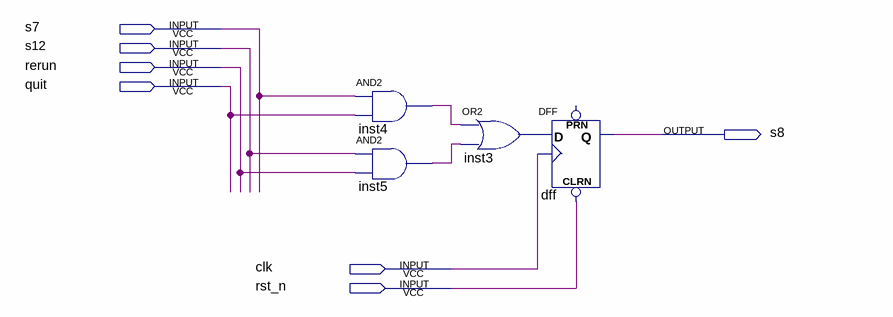
[diagram p0: schematic sheet]
// Quartus schematic s8.bdf as structural Verilog: 4 symbols, 7 pins
module s8 (
  input  s7,
  input  s12,
  input  rerun,
  input  quit,
  input  clk,
  input  rst_n,
  output s8
);

  wire inst3_out, inst4_out, inst5_out;

  and inst4 (inst4_out, s7, quit);
  and inst5 (inst5_out, s12, rerun);
  or inst3 (inst3_out, inst4_out, inst5_out);
  DFF dff (.CLRN(rst_n), .CLK(clk), .D(inst3_out), .Q(s8));  // open: PRN
endmodule
